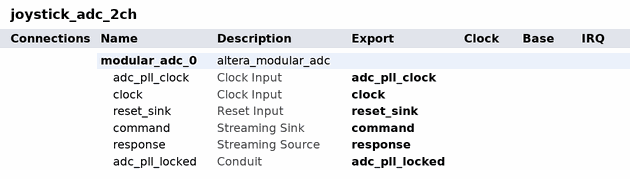
[diagram p0: system contents]
# Platform Designer (Qsys) system joystick_adc_2ch, MAX 10 10M50DAF484C7G
# Parameters at their usual value, and those the tool derives, are not listed.
package require -exact qsys 24.1
create_system joystick_adc_2ch
set_project_property DEVICE_FAMILY {MAX 10}
set_project_property DEVICE 10M50DAF484C7G

add_instance modular_adc_0 altera_modular_adc 24.1
set_instance_property modular_adc_0 AUTO_EXPORT true
set_instance_parameter_value modular_adc_0 CLOCK_FREQ 0
set_instance_parameter_value modular_adc_0 CORE_VAR 3
set_instance_parameter_value modular_adc_0 DEVICE_PART 10M50DAF484C7G
set_instance_parameter_value modular_adc_0 clkdiv 2
set_instance_parameter_value modular_adc_0 int_vref_vr 3.0
set_instance_parameter_value modular_adc_0 refsel 1
set_instance_parameter_value modular_adc_0 sample_rate 1
set_instance_parameter_value modular_adc_0 seq_order_length 1
set_instance_parameter_value modular_adc_0 seq_order_slot_1 30
set_instance_parameter_value modular_adc_0 seq_order_slot_2 30
set_instance_parameter_value modular_adc_0 seq_order_slot_3 30
set_instance_parameter_value modular_adc_0 seq_order_slot_4 30
set_instance_parameter_value modular_adc_0 seq_order_slot_5 30
set_instance_parameter_value modular_adc_0 seq_order_slot_6 30
set_instance_parameter_value modular_adc_0 seq_order_slot_7 30
set_instance_parameter_value modular_adc_0 use_ch0 true
set_instance_parameter_value modular_adc_0 use_ch2 true
set_instance_parameter_value modular_adc_0 use_ch3 true
set_instance_parameter_value modular_adc_0 use_ch4 false
set_instance_parameter_value modular_adc_0 use_ch5 false
set_instance_parameter_value modular_adc_0 use_ch6 false
set_instance_parameter_value modular_adc_0 use_ch7 false
set_instance_parameter_value modular_adc_0 use_ch8 false
set_instance_parameter_value modular_adc_0 use_tsd false

# exported interfaces
add_interface adc_pll_clock clock sink
set_interface_property adc_pll_clock EXPORT_OF modular_adc_0.adc_pll_clock
add_interface adc_pll_locked conduit end
set_interface_property adc_pll_locked EXPORT_OF modular_adc_0.adc_pll_locked
add_interface clock clock sink
set_interface_property clock EXPORT_OF modular_adc_0.clock
add_interface command avalon_streaming sink
set_interface_property command EXPORT_OF modular_adc_0.command
add_interface reset_sink reset sink
set_interface_property reset_sink EXPORT_OF modular_adc_0.reset_sink
add_interface response avalon_streaming source
set_interface_property response EXPORT_OF modular_adc_0.response

set_interconnect_requirement {$system} qsys_mm.clockCrossingAdapter HANDSHAKE
set_interconnect_requirement {$system} qsys_mm.enableEccProtection FALSE
set_interconnect_requirement {$system} qsys_mm.insertDefaultSlave FALSE
set_interconnect_requirement {$system} qsys_mm.maxAdditionalLatency 1

save_system joystick_adc_2ch.qsys
